# EAGLE design balanced-mod (EAGLE 6.6.0)
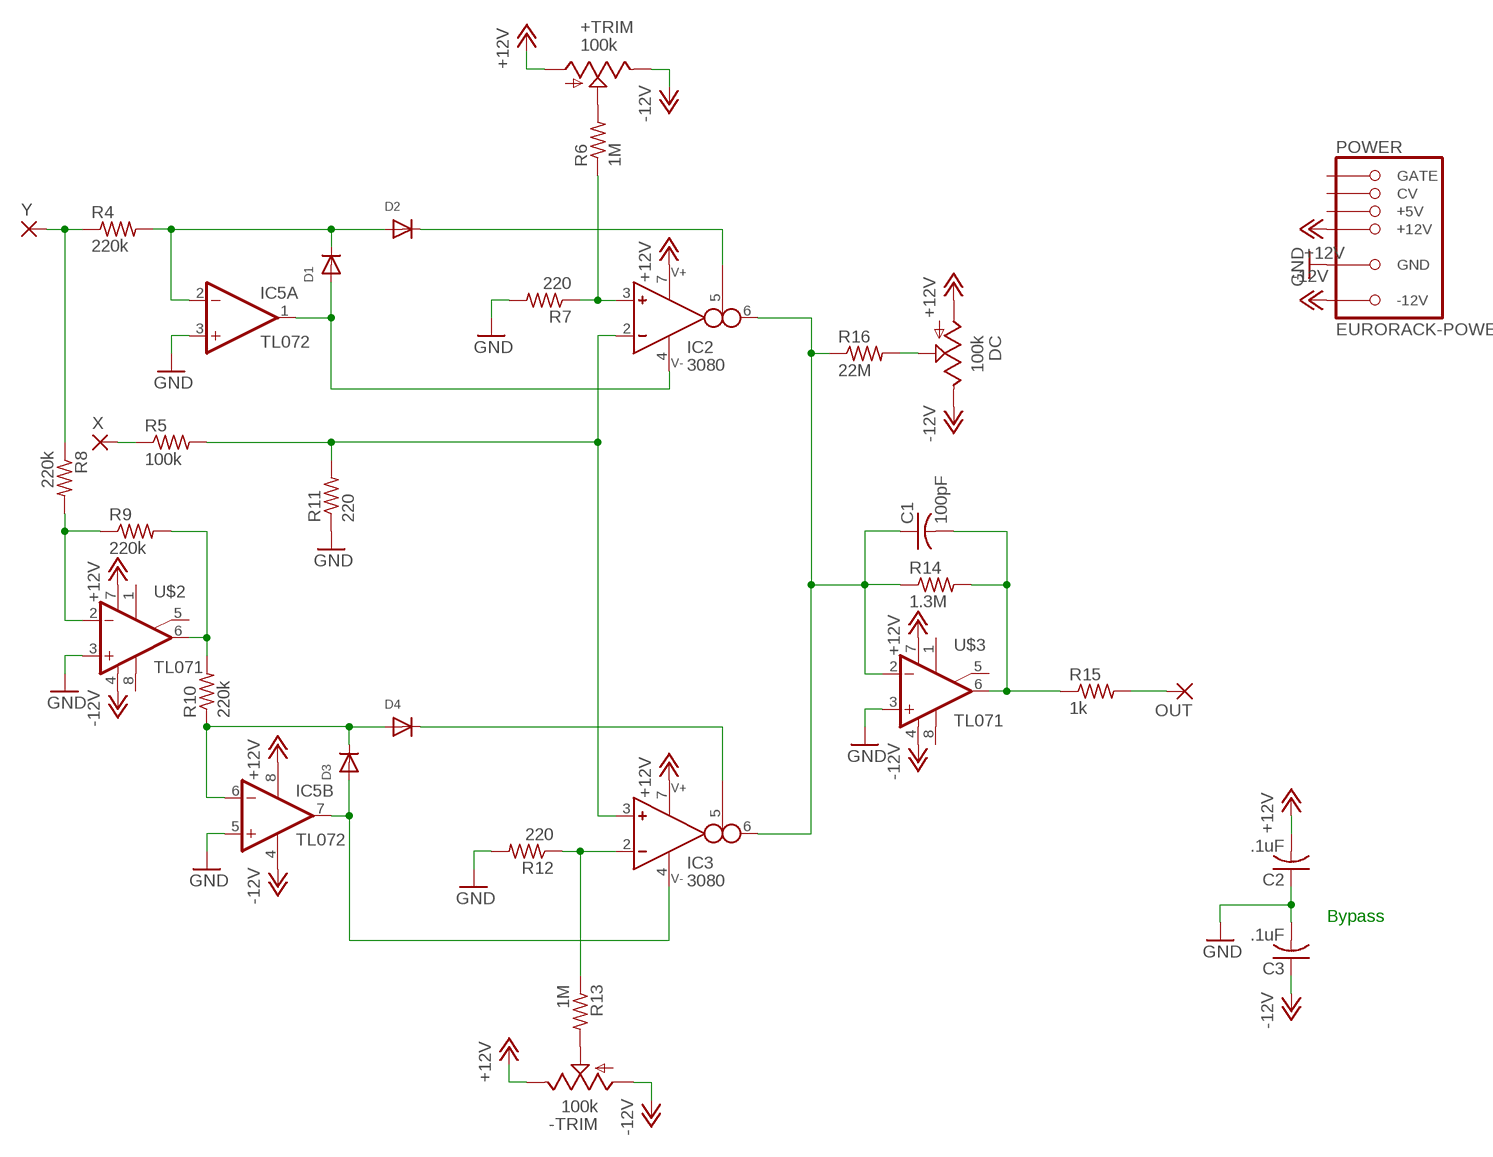
[diagram p0: schematic, sheet 1]

## Parts
+TRIM  100k  TRIM_US-RJ9W  [RJ9W]
-TRIM  100k  TRIM_US-RJ9W  [RJ9W]
C1  100pF  C-US050-025X075  [C050-025X075]
C2  .1uF  C-US050-025X075  [C050-025X075]
C3  .1uF  C-US050-025X075  [C050-025X075]
D1  DIODEDO-1N4148  [DO-1N4148]
D2  DIODEDO-1N4148  [DO-1N4148]
D3  DIODEDO-1N4148  [DO-1N4148]
D4  DIODEDO-1N4148  [DO-1N4148]
DC  100k  TRIM_US-RJ9W  [RJ9W]
IC2  3080  CA3080E  [DIL08]
IC3  3080  CA3080E  [DIL08]
IC5  TL072  TL072-TOPP  [DIL08]
OUT  2,54/1,0  [2,54/1,0]
POWER  EURORACK-POWER  [PINSHRD_PTH_2X8]
R4  220k  R-US_0207/10  [0207/10]
R5  100k  R-US_0207/10  [0207/10]
R6  1M  R-US_0207/10  [0207/10]
R7  220  R-US_0207/10  [0207/10]
R8  220k  R-US_0207/10  [0207/10]
R9  220k  R-US_0207/10  [0207/10]
R10  220k  R-US_0207/10  [0207/10]
R11  220  R-US_0207/10  [0207/10]
R12  220  R-US_0207/10  [0207/10]
R13  1M  R-US_0207/10  [0207/10]
R14  1.3M  R-US_0207/10  [0207/10]
R15  1k  R-US_0207/10  [0207/10]
R16  22M  R-US_0207/10  [0207/10]
U$2  TL071  TL071M  [DIL08]
U$3  TL071  TL071M  [DIL08]
X  2,54/1,0  [2,54/1,0]
Y  2,54/1,0  [2,54/1,0]

## Nets
+12V: +TRIM.A -TRIM.E C2.2 DC.A IC2.7 IC3.7 IC5.8(P:V+) POWER.+12V@1(+12V) POWER.+12V@2(+12V) U$2.7(V+) U$3.7(V+)
-12V: +TRIM.E -TRIM.A C3.1 DC.E IC5.4(P:V-) POWER.-12V@1(-12V) POWER.-12V@2(-12V) U$2.4(V-) U$3.4(V-)
GND: C2.1 C3.2 IC5.3(A:+IN) IC5.5(B:+IN) POWER.GND@1(GND) POWER.GND@2(GND) POWER.GND@3(GND) POWER.GND@4(GND) POWER.GND@5(GND) POWER.GND@6(GND) R7.2 R11.1 R12.2 U$2.3(+IN) U$3.3(+IN)
N$1: D1.C D2.A IC5.2(A:-IN) R4.2
N$2: R4.1 R8.1 Y.1(P)
N$3: R5.1 X.1(P)
N$4: +TRIM.S R6.2
N$5: IC2.3(IN_P) R6.1 R7.1
N$6: D2.C IC2.5(I_BIAS)
N$7: IC2.2(IN_N) IC3.3(IN_P) R5.2 R11.2
N$8: R8.2 R9.1 U$2.2(-IN)
N$9: C1.1 IC2.6(OUT) IC3.6(OUT) R14.1 R16.1 U$3.2(-IN)
N$10: DC.S R16.2
N$11: C1.2 R14.2 R15.1 U$3.6(OUT)
N$12: OUT.1(P) R15.2
N$13: R9.2 R10.2 U$2.6(OUT)
N$14: D3.C D4.A IC5.6(B:-IN) R10.1
N$15: D3.A IC3.4 IC5.7(B:OUT)
N$17: D4.C IC3.5(I_BIAS)
N$18: IC3.2(IN_N) R12.1 R13.1
N$19: -TRIM.S R13.2
V-: D1.A IC2.4 IC5.1(A:OUT)
Unconnected: POWER.+5V@1(+5V) POWER.+5V@2(+5V) POWER.CV@1(CV) POWER.CV@2(CV) POWER.GATE@1(GATE) POWER.GATE@2(GATE) U$2.1(ON1) U$2.5(ON2) U$2.8(OPT) U$3.1(ON1) U$3.5(ON2) U$3.8(OPT)

## Notes on the sheet
- Bypass

## Library data of the parts
+TRIM -TRIM DC = pot:TRIM_US-: POTENTIOMETER
C1-C3 = rcl:C-US: CAPACITOR, American symbol
D1-D4 = mmoretti:DIODE: Diode SMADIODE - SMA Surface Mount Package 20V 1A Schottky Diode Digikey: 641-1014-6-ND DO-1N4148 - Through Hole Small Current Diode SOD-123 20V 1 A (.5mV Vf) Schottky Diode - Digikey: MBRX120TPMSCT-ND SOD-323 10V 570mA (.38mV Vf, 3ns) Schottky Diode - Digikey: ZLLS410CT-ND SOD-523 30V 30mA Schottky Diode (RB751S-40TE61) - Digikey: RB751S-40TE61CT-ND SOT23-R/W - SOT23 Package (R = Solder Paste/Reflow Ovens, W = Hand-Soldering) BAT54Film 40V 300mA - Digikey: 497-7162-1-ND
IC2 IC3 = mmoretti:CA3080: OTA
IC5 = mmoretti:TL072-TOP: OP AMP
OUT X Y = wirepad:2,54/1,0: THROUGH-HOLE PAD
POWER = mmoretti:EURORACK-POWER
R4-R16 = rcl:R-US_: RESISTOR, American symbol
U$2 U$3 = mmoretti:TL071M

## Board
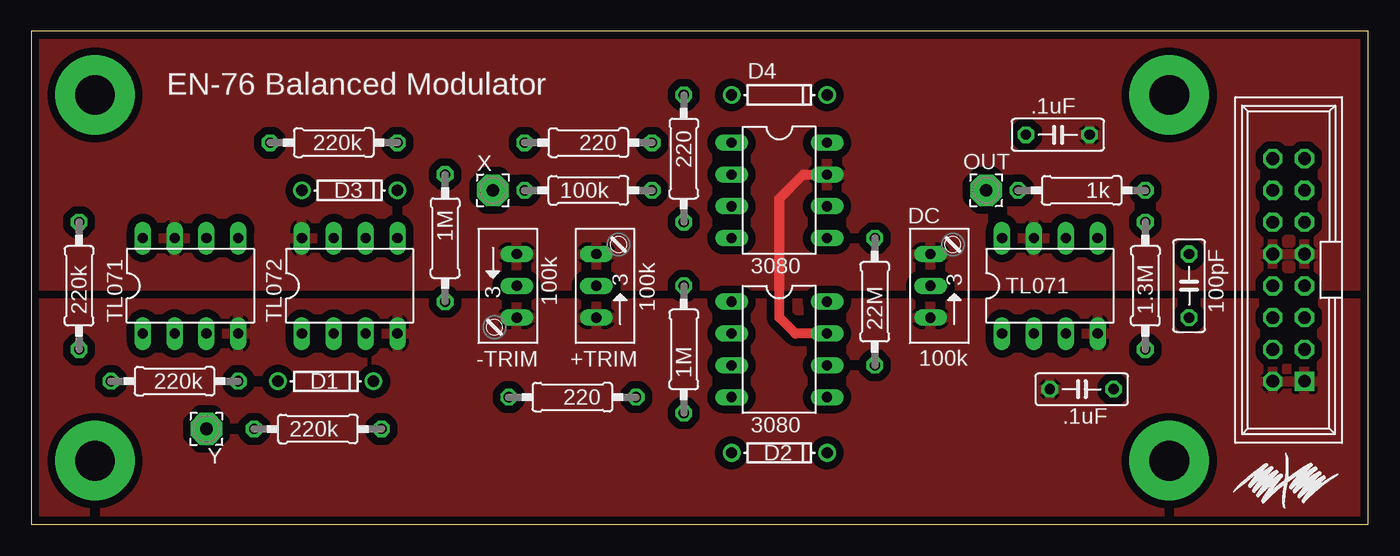
[diagram p1: board, top side]
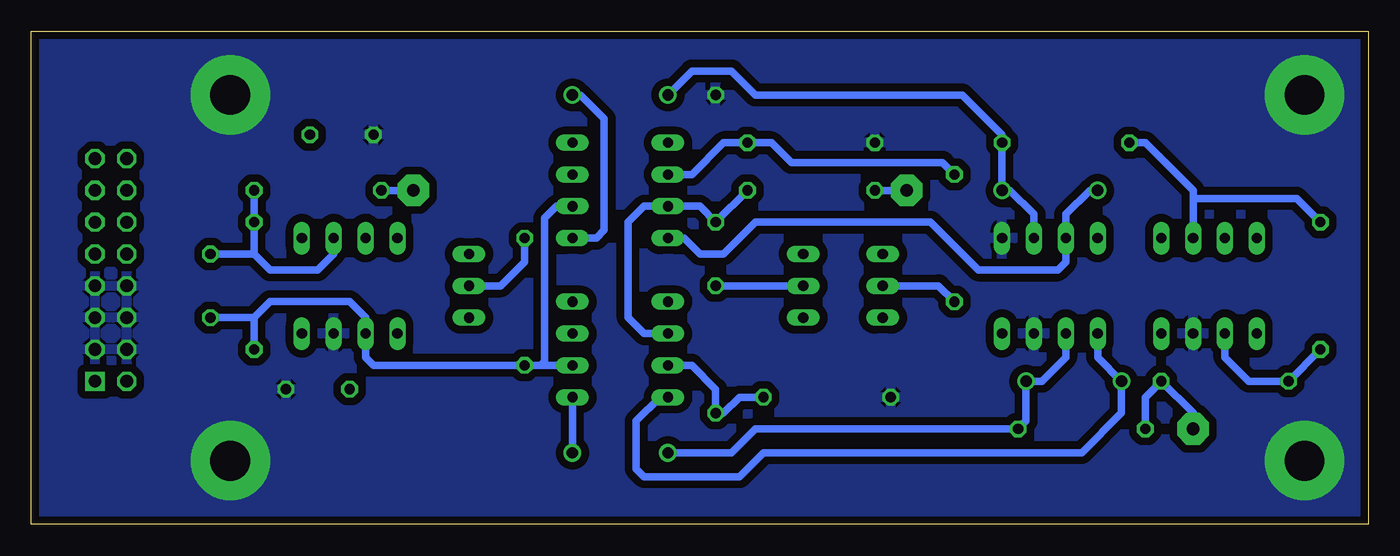
[diagram p2: board, bottom side, seen from below]

Size 106.68 x 39.37 mm. Coordinates in mm from the lower left corner, seen from the top.
Outline: 0,0 106.68,0 106.68,39.37 0,39.37 0,0
Copper layers (1*16): Top 0.035mm / dielectric 1.5mm / Bottom 0.035mm
Design rules "SeeedStudio_2layer_DRU_no_angle_20140221": minimum track width 6mil, minimum drill 12mil, track to track 6mil, track to pad 6mil, pad to pad 6mil, via to via 6mil, smd to smd 0mil, copper to edge 10mil, drill to drill 10mil, minimum pad ring 10mil, minimum via ring 6mil, stop-mask expansion 2mil, vias tented up to drill 100mil, thermal gap 10mil

### Footprints (pad centres in the part's own frame; a part is rotated, then mirrored left to right if it is on the bottom)
RJ9W = drill 0.813 long: A 2.54,0.635; E -2.54,0.635; S 0,0.635
C050-025X075 = drill 0.813 octagon: 1 -2.54,0; 2 2.54,0
DO-1N4148 = drill 0.9: A -3.81,0; C 3.81,0
DIL08 = drill 0.813 long: 1 -3.81,-3.81; 2 -1.27,-3.81; 3 1.27,-3.81; 4 3.81,-3.81; 5 3.81,3.81; 6 1.27,3.81; 7 -1.27,3.81; 8 -3.81,3.81
2,54/1,0 = drill 1.016 pad 2.54 octagon: 1 0,0
PINSHRD_PTH_2X8 = drill 1.016 octagon: +5V@1 3.81,1.27; +5V@2 3.81,-1.27; +12V@1 1.27,1.27; +12V@2 1.27,-1.27; -12V@1 -8.89,1.27; CV@1 6.35,1.27; CV@2 6.35,-1.27; GATE@1 8.89,1.27; GATE@2 8.89,-1.27; GND@1 -6.35,1.27; GND@2 -6.35,-1.27; GND@3 -3.81,1.27; GND@4 -3.81,-1.27; GND@5 -1.27,1.27; GND@6 -1.27,-1.27 | drill 1.016 square: -12V@2 -8.89,-1.27
0207/10 = drill 0.813 octagon: 1 -5.08,0; 2 5.08,0

### Placement (x,y rotation side)
+TRIM  45.72,19.05 90 top
-TRIM  38.1,19.05 270 top
C1  92.39,19.05 90 top
C2  81.92,31.11 0 top
C3  83.82,10.79 0 top
D1  23.5,11.43 0 top
D2  59.69,5.71 0 top
D3  25.4,26.67 0 top
D4  59.69,34.29 0 top
DC  72.39,19.05 90 top
IC2  59.69,13.97 270 top
IC3  59.69,26.67 270 top
IC5  25.4,19.05 0 top
OUT  76.2,26.67 180 top
POWER  100.33,20.32 90 top
R4  22.86,7.62 0 top
R5  44.45,26.67 0 top
R6  52.07,13.97 90 top
R7  43.18,10.16 180 top
R8  11.43,11.43 180 top
R9  3.81,19.05 90 top
R10  24.13,30.48 180 top
R11  52.07,29.21 270 top
R12  44.45,30.48 180 top
R13  33.02,22.86 270 top
R14  88.9,19.05 90 top
R15  83.82,26.67 180 top
R16  67.31,17.78 90 top
U$2  12.7,19.05 0 top
U$3  81.28,19.05 0 top
X  36.83,26.67 0 top
Y  13.97,7.62 180 top

### Tracks (layer width: path | path; a pad name or v marks a point on that pad's centre or on a via)
+12V
  Top 0.813: IC2.7 60.96,15.24 59.69,16.51 59.69,26.04 61.59,27.94 IC3.7
  pour Top (isolate 0.61): 0,39.37 106.68,39.37 106.68,19.05 0,19.05
-12V
  pour Top (isolate 0.61, rank 2): 0,19.05 106.68,19.05 106.68,0 0,0
GND  (via drill 3.17 pad 6.35)
  other vias: 5.08,5.08 5.08,34.29 90.81,5.08 90.81,34.29
  pour Bottom (isolate 0.61): 0,39.37 106.68,39.37 106.68,0 0,0
N$1
  Bottom 0.61: IC5.2 24.13,13.34 26.04,11.43 D1.C 27.3,8.26 R4.2 48.9,7.62 50.8,5.71 D2.A
N$2
  Bottom 0.61: Y.1 13.97,8.89 R8.1 17.78,10.16 R4.1
N$3
  Bottom 0.61: X.1 R5.1
N$4
  Bottom 0.61: R6.2 +TRIM.S
N$5
  Bottom 0.61: R7.1 50.16,10.16 51.44,8.89 R6.1 52.07,10.79 53.98,12.7 IC2.3
N$6
  Bottom 0.61: D2.C IC2.5
N$7
  Bottom 0.61: IC2.2 57.78,15.24 59.05,16.51 59.05,24.13 57.78,25.4 IC3.3 53.34,25.4 R11.2 R5.2
N$8
  Bottom 0.61: R9.1 R8.2 9.53,11.43 11.43,13.34 U$2.2
N$9
  Bottom 0.61: IC3.6 64.77,25.4 65.72,24.45 65.72,13.02 66.04,12.7 | IC2.6 66.04,12.7 | 66.04,12.7 R16.1 79.38,12.7 80.01,13.34 U$3.2 80.01,16.51 81.28,17.78 87.63,17.78 88.9,16.51 | R14.1 88.9,16.51 | C1.1 88.9,16.51
N$10
  Bottom 0.61: DC.S 69.22,19.05 67.31,20.95 R16.2
N$11
  Bottom 0.61: U$3.6 82.55,21.59 83.82,20.32 87.63,20.32 88.9,21.59 | 88.9,21.59 R14.2 R15.1 | C1.2 88.9,21.59
N$12
  Bottom 0.61: OUT.1 R15.2
N$13
  Bottom 0.61: U$2.6 13.97,26.04 | 13.97,26.04 13.97,26.67 17.78,30.48 R10.2 | R9.2 5.71,26.04 13.97,26.04
N$14
  Bottom 0.61: IC5.6 26.67,24.77 28.57,26.67 D3.C R10.1 29.21,31.11 32.38,34.29 48.9,34.29 50.8,36.2 53.98,36.2 D4.A
N$15
  Bottom 0.61: IC3.4 54.61,22.86 53.34,21.59 51.44,21.59 48.9,24.13 34.92,24.13 31.11,20.32 24.77,20.32 24.13,20.95 IC5.7 24.13,24.77 22.23,26.67 D3.A
N$17
  Bottom 0.61: D4.C 62.87,34.29 60.96,32.38 60.96,23.5 61.59,22.86 IC3.5
N$18
  Bottom 0.61: R13.1 33.97,28.89 46.04,28.89 47.62,30.48 R12.1 51.44,30.48 53.98,27.94 IC3.2
N$19
  Bottom 0.61: -TRIM.S 34.29,19.05 R13.2
V-
  Bottom 0.61: IC5.1 21.59,13.34 D1.A 19.68,8.89 22.86,5.71 48.26,5.71 50.16,3.81 57.78,3.81 58.42,4.45 58.42,8.26 56.52,10.16 IC2.4

### Text on the board
tNames: EN-76 Balanced Modulator